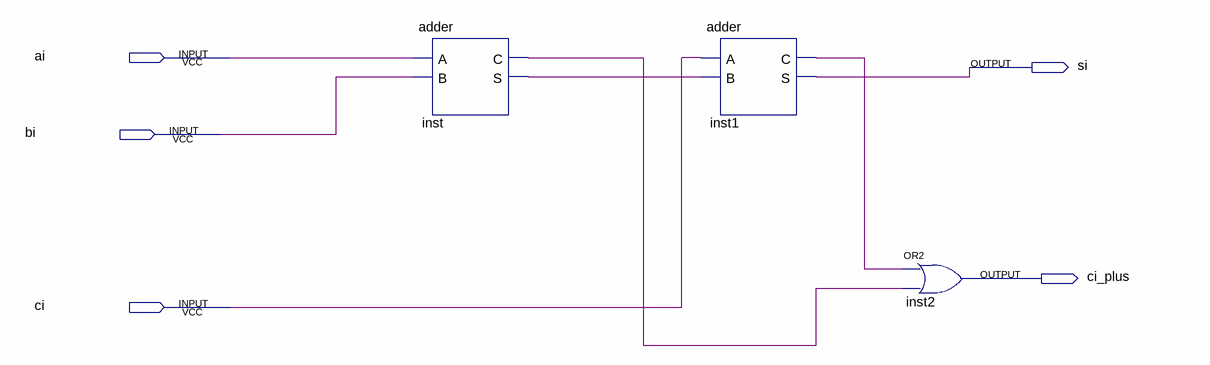
[diagram p0: schematic sheet]
// Quartus schematic fulladder.bdf as structural Verilog: 3 symbols, 5 pins
module fulladder (
  input  ai,
  input  bi,
  input  ci,
  output si,
  output ci_plus
);

  wire inst1_c, inst_c, inst_s;

  adder inst (.A(ai), .B(bi), .C(inst_c), .S(inst_s));
  adder inst1 (.A(ci), .B(inst_s), .C(inst1_c), .S(si));
  or inst2 (ci_plus, inst1_c, inst_c);
endmodule
